# Altium schematic sheet HDMI2.SchDoc
size A3; SheetNumber: 8; SheetTotal: 11
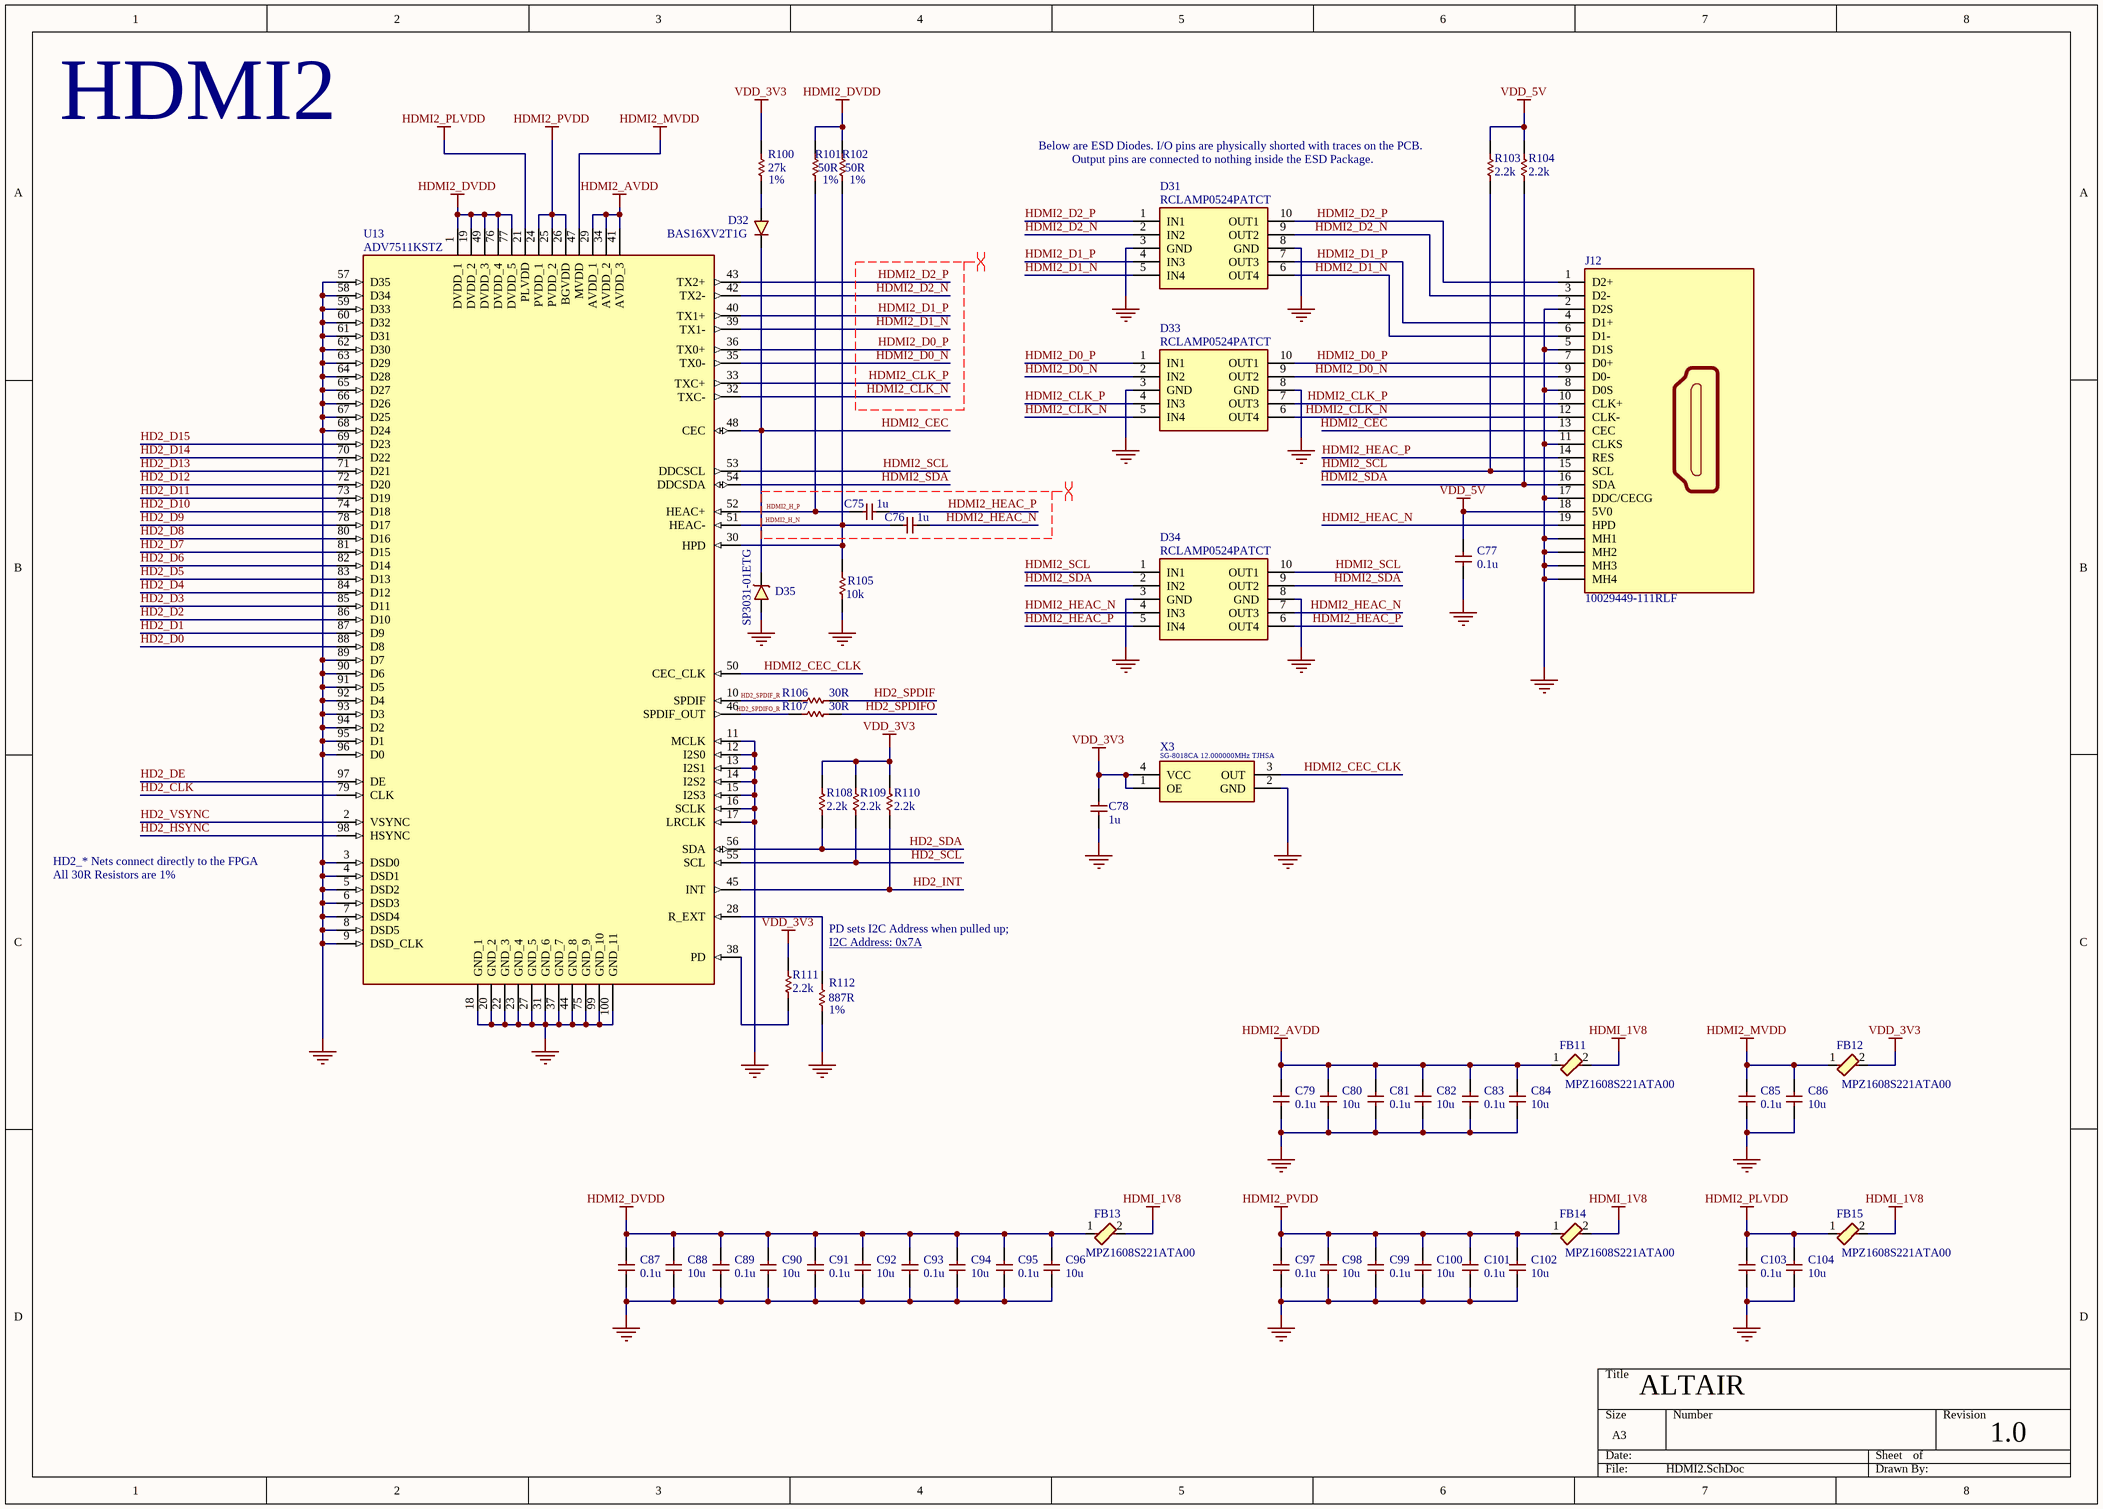
[diagram p0: HDMI2.SchDoc]

## Parts
C75  1u  [CAP_0402]
C76  1u  [CAP_0402]
C77  0.1u  [CAP_0402]
C78  1u  [CAP_0402]
C79  0.1u  [CAP_0402]
C80  10u  [CAP_0402]
C81  0.1u  [CAP_0402]
C82  10u  [CAP_0402]
C83  0.1u  [CAP_0402]
C84  10u  [CAP_0402]
C85  0.1u  [CAP_0402]
C86  10u  [CAP_0402]
C87  0.1u  [CAP_0402]
C88  10u  [CAP_0402]
C89  0.1u  [CAP_0402]
C90  10u  [CAP_0402]
C91  0.1u  [CAP_0402]
C92  10u  [CAP_0402]
C93  0.1u  [CAP_0402]
C94  10u  [CAP_0402]
C95  0.1u  [CAP_0402]
C96  10u  [CAP_0402]
C97  0.1u  [CAP_0402]
C98  10u  [CAP_0402]
C99  0.1u  [CAP_0402]
C100  10u  [CAP_0402]
C101  0.1u  [CAP_0402]
C102  10u  [CAP_0402]
C103  0.1u  [CAP_0402]
C104  10u  [CAP_0402]
D31  RCLAMP0524PATCT  [RCLAMP0524PATCT]
D32  BAS16XV2T1G  [SODFL1608X70N]
D33  RCLAMP0524PATCT  [RCLAMP0524PATCT]
D34  RCLAMP0524PATCT  [RCLAMP0524PATCT]
D35  SP3031-01ETG  [SP303101ETG]
FB11  220  [BEADC1608X75N]  (value not drawn)
FB12  220  [BEADC1608X75N]  (value not drawn)
FB13  220  [BEADC1608X75N]  (value not drawn)
FB14  220  [BEADC1608X75N]  (value not drawn)
FB15  220  [BEADC1608X75N]  (value not drawn)
J12  10029449-111RLF  [10029449111RLF]
R100  27k  Note/Misc: 1%  [RES_0402]
R101  50R  Note/Misc: 1%  [RES_0402]
R102  50R  Note/Misc: 1%  [RES_0402]
R103  2.2k  [RES_0402]
R104  2.2k  [RES_0402]
R105  10k  [RES_0402]
R106  30R  [RES_0402]
R107  30R  [RES_0402]
R108  2.2k  [RES_0402]
R109  2.2k  [RES_0402]
R110  2.2k  [RES_0402]
R111  2.2k  [RES_0402]
R112  887R  Note/Misc: 1%  [RES_0402]
U13  ADV7511KSTZ  [QFP50P1600X1600X160-100N]
X3  SG-8018CA 12.000000MHz TJHSA  [SG8018CA147456MTJHPA3]  (value not drawn)

## Nets
GND: C77.1 C78.2 C79.1 C80.2 C81.1 C82.2 C83.1 C84.2 C85.1 C86.2 C87.1 C88.2 C89.1 C90.2 C91.1 C92.2 C93.1 C94.2 C95.1 C96.2 C97.1 C98.2 C99.1 C100.2 C101.1 C102.2 C103.1 C104.2 D31.3(GND) D31.8(GND) D33.3(GND) D33.8(GND) D34.3(GND) D34.8(GND) D35.2(A) J12.2(D2S) J12.5(D1S) J12.8(D0S) J12.11(CLKS) J12.17(DDC/CECG) J12.MH1 J12.MH2 J12.MH3 J12.MH4 R105.2 R112.2 U13.3(DSD0) U13.4(DSD1) U13.5(DSD2) U13.6(DSD3) U13.7(DSD4) U13.8(DSD5) U13.9(DSD_CLK) U13.11(MCLK) U13.12(I2S0) U13.13(I2S1) U13.14(I2S2) U13.15(I2S3) U13.16(SCLK) U13.17(LRCLK) U13.18(GND_1) U13.20(GND_2) U13.22(GND_3) U13.23(GND_4) U13.27(GND_5) U13.31(GND_6) U13.37(GND_7) U13.44(GND_8) U13.57(D35) U13.58(D34) U13.59(D33) U13.60(D32) U13.61(D31) U13.62(D30) U13.63(D29) U13.64(D28) U13.65(D27) U13.66(D26) U13.67(D25) U13.68(D24) U13.75(GND_9) U13.89(D7) U13.90(D6) U13.91(D5) U13.92(D4) U13.93(D3) U13.94(D2) U13.95(D1) U13.96(D0) U13.99(GND_10) U13.100(GND_11) X3.2(GND)
HDMI2_AVDD: C79.2 C80.1 C81.2 C82.1 C83.2 C84.1 FB11.1 U13.29(AVDD_1) U13.34(AVDD_2) U13.41(AVDD_3)
HDMI2_DVDD: C87.2 C88.1 C89.2 C90.1 C91.2 C92.1 C93.2 C94.1 C95.2 C96.1 FB13.1 R101.1 R102.1 U13.1(DVDD_1) U13.19(DVDD_2) U13.49(DVDD_3) U13.76(DVDD_4) U13.77(DVDD_5)
HDMI2_MVDD: C85.2 C86.1 FB12.1 U13.47(MVDD)
HDMI2_PLVDD: C103.2 C104.1 FB15.1 U13.21(PLVDD)
HDMI2_PVDD: C97.2 C98.1 C99.2 C100.1 C101.2 C102.1 FB14.1 U13.24(PVDD_1) U13.25(PVDD_2) U13.26(BGVDD)
HDMI_1V8: FB11.2 FB13.2 FB14.2 FB15.2
VDD_3V3: C78.1 FB12.2 R100.1 R108.2 R109.2 R110.2 R111.1 X3.1(OE) X3.4(VCC)
VDD_5V: C77.2 J12.18(5V0) R103.2 R104.2
HD2_CLK: U13.79(CLK)
HD2_D0: U13.88(D8)
HD2_D1: U13.87(D9)
HD2_D2: U13.86(D10)
HD2_D3: U13.85(D11)
HD2_D4: U13.84(D12)
HD2_D5: U13.83(D13)
HD2_D6: U13.82(D14)
HD2_D7: U13.81(D15)
HD2_D8: U13.80(D16)
HD2_D9: U13.78(D17)
HD2_D10: U13.74(D18)
HD2_D11: U13.73(D19)
HD2_D12: U13.72(D20)
HD2_D13: U13.71(D21)
HD2_D14: U13.70(D22)
HD2_D15: U13.69(D23)
HD2_DE: U13.97(DE)
HD2_HSYNC: U13.98(HSYNC)
HD2_INT: R110.1 U13.45(INT)
HD2_SCL: R109.1 U13.55(SCL)
HD2_SDA: R108.1 U13.56(SDA)
HD2_SPDIF: R106.2
HD2_SPDIF_R: R106.1 U13.10(SPDIF)
HD2_SPDIFO: R107.2
HD2_SPDIFO_R: R107.1 U13.46(SPDIF_OUT)
HD2_VSYNC: U13.2(VSYNC)
HDMI2_CEC: D32.1(K) D35.1(K) J12.13(CEC) U13.48(CEC)
HDMI2_CEC_CLK: U13.50(CEC_CLK) X3.3(OUT)
HDMI2_CLK_N: D33.5(IN4) D33.6(OUT4) J12.12(CLK-) U13.32(TXC-)
HDMI2_CLK_P: D33.4(IN3) D33.7(OUT3) J12.10(CLK+) U13.33(TXC+)
HDMI2_D0_N: D33.2(IN2) D33.9(OUT2) J12.9(D0-) U13.35(TX0-)
HDMI2_D0_P: D33.1(IN1) D33.10(OUT1) J12.7(D0+) U13.36(TX0+)
HDMI2_D1_N: D31.5(IN4) D31.6(OUT4) J12.6(D1-) U13.39(TX1-)
HDMI2_D1_P: D31.4(IN3) D31.7(OUT3) J12.4(D1+) U13.40(TX1+)
HDMI2_D2_N: D31.2(IN2) D31.9(OUT2) J12.3(D2-) U13.42(TX2-)
HDMI2_D2_P: D31.1(IN1) D31.10(OUT1) J12.1(D2+) U13.43(TX2+)
HDMI2_H_N: C76.2 R102.2 R105.1 U13.30(HPD) U13.51(HEAC-)
HDMI2_H_P: C75.2 R101.2 U13.52(HEAC+)
HDMI2_HEAC_N: C76.1 D34.4(IN3) D34.7(OUT3) J12.19(HPD)
HDMI2_HEAC_P: C75.1 D34.5(IN4) D34.6(OUT4) J12.14(RES)
HDMI2_SCL: D34.1(IN1) D34.10(OUT1) J12.15(SCL) R103.1 U13.53(DDCSCL)
HDMI2_SDA: D34.2(IN2) D34.9(OUT2) J12.16(SDA) R104.1 U13.54(DDCSDA)
NetD32_2: D32.2(A) R100.2
NetR111_2: R111.2 U13.38(PD)
NetR112_1: R112.1 U13.28(R_EXT)

## Layout directives
differential pair: HDMI2_CLK_N, HDMI2_CLK_P, HDMI2_D0_N, HDMI2_D0_P, HDMI2_D1_N, HDMI2_D1_P, HDMI2_D2_N, HDMI2_D2_P, HDMI2_H_N, HDMI2_H_P, HDMI2_HEAC_N, HDMI2_HEAC_P

## Notes on the sheet
- HDMI2
- (near R103) Below are ESD Diodes. I/O pins are physically shorted with traces on the PCB.
- Output pins are connected to nothing inside the ESD Package.
- (near X3) SG-8018CA 12.000000MHz TJHSA
- HD2_* Nets connect directly to the FPGA
- All 30R Resistors are 1%
- PD sets I2C Address when pulled up;
- I2C Address: 0x7A
- ALTAIR
- 1.0

## Library data of the parts
C75 C76 C78 = CAP_0402: Capacitor SMD 0402; Part No: CL05A105KP5NNNC; Note/Misc: 10V; LCSC: *; JLCPCB Part #: C14445; Footprint JLCPCB: 0402
C77 C79 C81 C83 C85 C87 C89 C91 C93 C95 C97 C99 C101 C103 = CAP_0402: Capacitor SMD 0402; Part No: CL05B104KO5NNNC; Note/Misc: 16V, 0402; LCSC: *; JLCPCB Part #: C338112; Footprint JLCPCB: 0402
C80 C82 C84 C86 C88 C90 C92 C94 C96 C98 C100 C102 C104 = CAP_0402: Capacitor SMD 0402; Part No: CL05A106MP5NUNC; LCSC: *; JLCPCB Part #: C315248; Footprint JLCPCB: 0402
D31 D33 D34 = RCLAMP0524PATCT: TVS Diode (Uni-directional); LCSC: *; Note/Misc: *; Part No: RCLAMP0524PATCT; JLCPCB Part #: C40960; Footprint JLCPCB: DFN-10(1x2.5)
D32 = BAS16XV2T1G: Diode (Switching); LCSC: *; Note/Misc: *; Part No: BAS16XV2T1G; JLCPCB Part #: C152479; Footprint JLCPCB: SOD-523
D35 = SP3031-01ETG: TVS Diode (Uni-directional); Footprint JLCPCB: SOD-882; JLCPCB Part #: C207283; LCSC: *; Note/Misc: *; Part No: SP3031-01ETG
FB11-FB15 = MPZ1608S221ATA00: Ferrite Bead; LCSC: *; Note/Misc: *; Part No: MPZ1608S221ATA00; JLCPCB Part #: C76815; Footprint JLCPCB: 0603
J12 = 10029449-111RLF: HDMI Connector; LCSC: *; Note/Misc: *; Part No: 10029449-111RLF; JLCPCB Part #: C427307; Footprint JLCPCB: SMD
R100 = RES_0402: Resistor SMD 0402; Part No: RC0402FR-0727KL; LCSC: *; JLCPCB Part #: C138022; Footprint JLCPCB: 0402
R101 R102 = RES_0402: Resistor SMD 0402; Part No: RT0402BRE0750RL; LCSC: *; JLCPCB Part #: C853312; Footprint JLCPCB: 0402
R103 R104 R108-R111 = RES_0402: Resistor SMD 0402; Part No: RC0402JR-072K2L; LCSC: *; JLCPCB Part #: C163447; Footprint JLCPCB: 0402
R105 = RES_0402: Resistor SMD 0402; Part No: RC0402JR-0710KL; LCSC: *; JLCPCB Part #: C60489; Footprint JLCPCB: 0402
R106 R107 = RES_0402: Resistor SMD 0402; Part No: RC0402FR-0730RL; Note/Misc: 1%; LCSC: *; JLCPCB Part #: C138007; Footprint JLCPCB: 0402
R112 = RES_0402: Resistor SMD 0402; Part No: CRCW0402887RFKED; LCSC: *; JLCPCB Part #: C4012675; Footprint JLCPCB: 0402
U13 = ADV7511KSTZ: HDMI RX IC; LCSC: *; Note/Misc: *; Part No: ADV7511KSTZ; JLCPCB Part #: C179459; Footprint JLCPCB: LQFP-100(14x14)
X3 = SG-8018CA 12.000000MHz TJHSA: 12 MHz Programmable Oscillator; LCSC: *; Note/Misc: *; JLCPCB Part #: C390417; Footprint JLCPCB: SMD7050-4P; Part No: SG-8018CA 12.000000MHz TJHSA